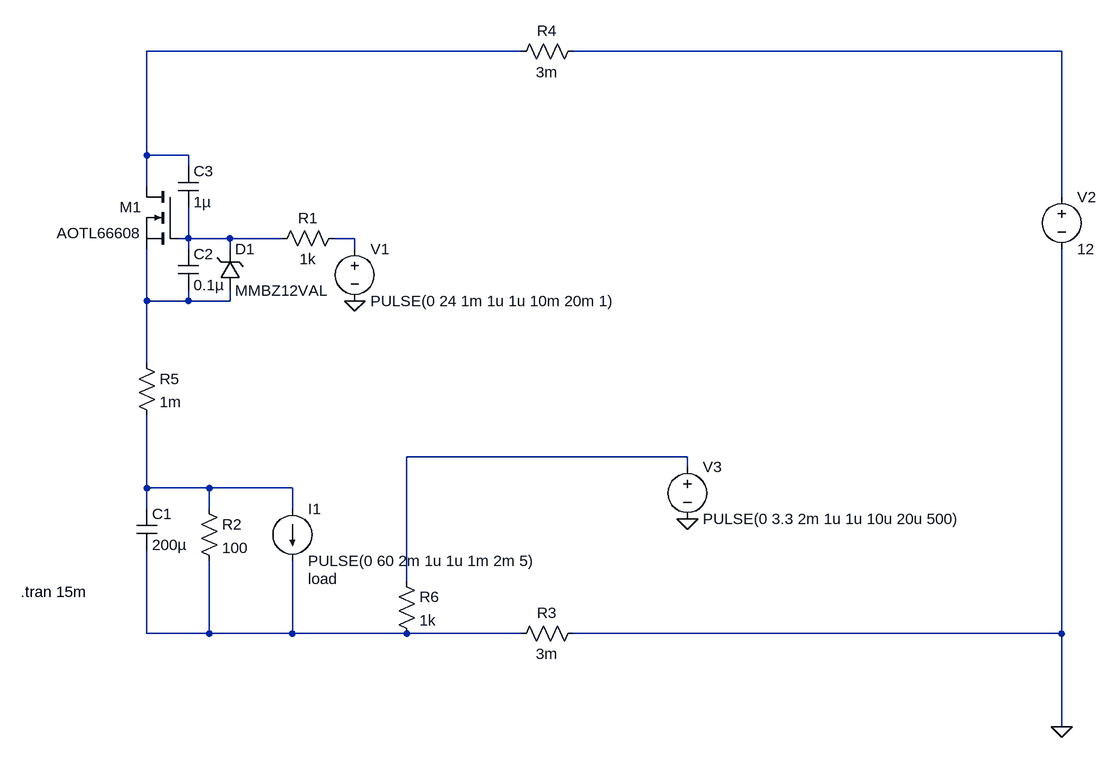
[diagram p0: schematic ESC_PWR_SW.asc]
ESC_PWR_SW.asc, the LTspice schematic file:
Version 4
SHEET 1 1672 680
WIRE 784 -432 208 -432
WIRE 1616 -432 864 -432
WIRE 208 -272 208 -432
WIRE 272 -272 208 -272
WIRE 272 -256 272 -272
WIRE 208 -224 208 -272
WIRE 1616 -208 1616 -432
WIRE 272 -144 272 -192
WIRE 272 -144 256 -144
WIRE 336 -144 272 -144
WIRE 416 -144 336 -144
WIRE 528 -144 496 -144
WIRE 272 -128 272 -144
WIRE 336 -128 336 -144
WIRE 528 -128 528 -144
WIRE 208 -48 208 -128
WIRE 272 -48 272 -64
WIRE 272 -48 208 -48
WIRE 336 -48 336 -64
WIRE 336 -48 272 -48
WIRE 208 48 208 -48
WIRE 1040 192 608 192
WIRE 1040 208 1040 192
WIRE 208 240 208 128
WIRE 304 240 208 240
WIRE 432 240 304 240
WIRE 208 272 208 240
WIRE 304 272 304 240
WIRE 432 272 432 240
WIRE 608 384 608 192
WIRE 208 464 208 336
WIRE 304 464 304 352
WIRE 304 464 208 464
WIRE 432 464 432 352
WIRE 432 464 304 464
WIRE 608 464 432 464
WIRE 784 464 608 464
WIRE 1616 464 1616 -128
WIRE 1616 464 864 464
WIRE 1616 608 1616 464
FLAG 1616 608 0
FLAG 528 -48 0
FLAG 1040 288 0
SYMBOL nmos 256 -224 M0
SYMATTR InstName M1
SYMATTR Value AOTL66608
SYMBOL cap 192 272 R0
SYMATTR InstName C1
SYMATTR Value 200µ
SYMBOL res 288 256 R0
SYMATTR InstName R2
SYMATTR Value 100
SYMBOL voltage 1616 -224 R0
SYMATTR InstName V2
SYMATTR Value 12
SYMBOL current 432 272 R0
WINDOW 123 0 0 Left 0
WINDOW 39 24 108 Left 2
SYMATTR InstName I1
SYMATTR Value PULSE(0 60 2m 1u 1u 1m 2m 5)
SYMATTR SpiceLine load
SYMBOL voltage 528 -144 R0
WINDOW 123 0 0 Left 0
WINDOW 39 0 0 Left 0
SYMATTR InstName V1
SYMATTR Value PULSE(0 24 1m 1u 1u 10m 20m 1)
SYMBOL res 512 -160 R90
WINDOW 0 0 56 VBottom 2
WINDOW 3 32 56 VTop 2
SYMATTR InstName R1
SYMATTR Value 1k
SYMBOL cap 256 -128 R0
SYMATTR InstName C2
SYMATTR Value 0.1µ
SYMBOL cap 256 -256 R0
SYMATTR InstName C3
SYMATTR Value 1µ
SYMBOL zener 320 -64 M180
WINDOW 0 24 64 Left 2
WINDOW 3 24 0 Left 2
SYMATTR InstName D1
SYMATTR Value MMBZ12VAL
SYMATTR Description Diode
SYMATTR Type diode
SYMBOL res 880 448 R90
WINDOW 0 0 56 VBottom 2
WINDOW 3 32 56 VTop 2
SYMATTR InstName R3
SYMATTR Value 3m
SYMBOL res 880 -448 R90
WINDOW 0 0 56 VBottom 2
WINDOW 3 32 56 VTop 2
SYMATTR InstName R4
SYMATTR Value 3m
SYMBOL res 192 32 R0
SYMATTR InstName R5
SYMATTR Value 1m
SYMBOL voltage 1040 192 R0
WINDOW 123 0 0 Left 0
WINDOW 39 0 0 Left 0
SYMATTR InstName V3
SYMATTR Value PULSE(0 3.3 2m 1u 1u 10u 20u 500)
SYMBOL res 592 368 R0
SYMATTR InstName R6
SYMATTR Value 1k
TEXT 14 400 Left 2 !.tran 15m

The netlist it stands for:
* ESC_PWR_SW.asc
M1 N001 N003 N005 N005 AOTL66608
C1 N007 N008 200µ
R2 N007 N008 100
V2 N002 0 12
I1 N007 N008 PULSE(0 60 2m 1u 1u 1m 2m 5) load
V1 N004 0 PULSE(0 24 1m 1u 1u 10m 20m 1)
R1 N004 N003 1k
C2 N003 N005 0.1µ
C3 N001 N003 1µ
D1 N005 N003 MMBZ12VAL
R3 0 N008 3m
R4 N002 N001 3m
R5 N005 N007 1m
V3 N006 0 PULSE(0 3.3 2m 1u 1u 10u 20u 500)
R6 N006 N008 1k
.model D D
.lib standard.dio
.model NMOS NMOS
.model PMOS PMOS
.lib standard.mos
.tran 15m
.backanno
.end